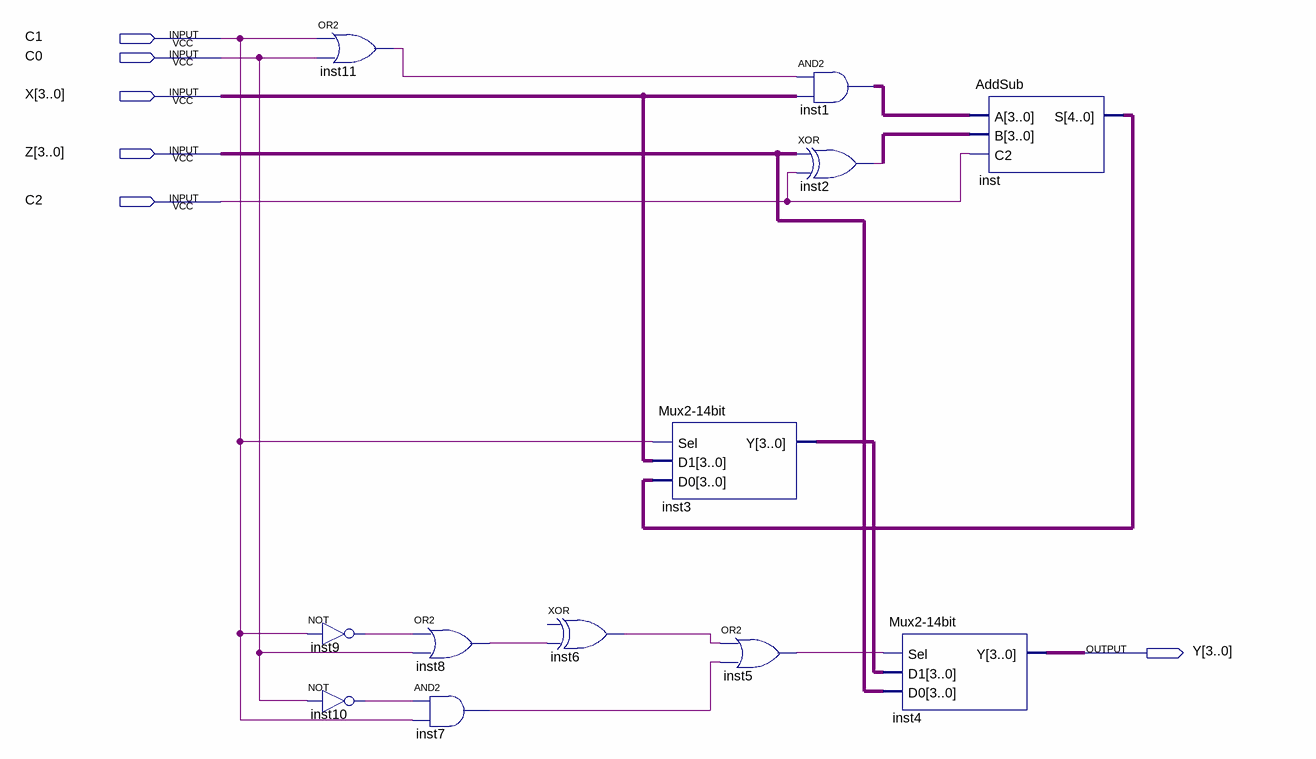
[diagram p0: schematic sheet]
// Quartus schematic Block15.bdf as structural Verilog: 12 symbols, 6 pins
module Block15 (
  input  C1,
  input  C0,
  input  [3:0] X,
  input  [3:0] Z,
  input  C2,
  output [3:0] Y
);

  wire inst2_out, inst5_out, inst6_out, inst7_out, inst8_out, inst9_out, inst10_out, inst11_out;
  wire [3:0] inst1_out, inst3_y, undriven;
  wire [4:0] inst_s;

  or inst11 (inst11_out, C1, C0);
  not inst9 (inst9_out, C1);
  not inst10 (inst10_out, C0);
  or inst8 (inst8_out, inst9_out, C0);
  and inst7 (inst7_out, inst10_out, C1);
  buf inst6 (inst6_out, inst8_out);  // XOR open: IN1
  \Mux2-14bit  inst3 (.Sel(C1), .D0(inst_s), .D1(X), .Y(inst3_y));
  or inst5 (inst5_out, inst6_out, inst7_out);
  assign inst1_out = {4{inst11_out}} & X;  // AND2 inst1, 4 bits wide
  assign inst2_out = Z ^ {4{C2}};  // XOR inst2, 4 bits wide
  \Mux2-14bit  inst4 (.Sel(inst5_out), .D0(Z), .D1(inst3_y), .Y(Y));
  AddSub inst (.A(inst1_out), .B(undriven), .C2(C2), .S(inst_s));
endmodule
